# Altium schematic sheet Cover Page.SchDoc: [1] Cover Page
size A3; ApprovedBy: Nagy Richard; CheckedBy: Nagy Richard; Author: Nagy Richard; CompanyName: EmbedCore; DrawnBy: Nagy Richard; Engineer: Nagy Richard; Organization: EmbedCore; Revision: 1.0; SheetNumber: 1; SheetTotal: 24; ImagePath: .\Logo\EmbedCore.png
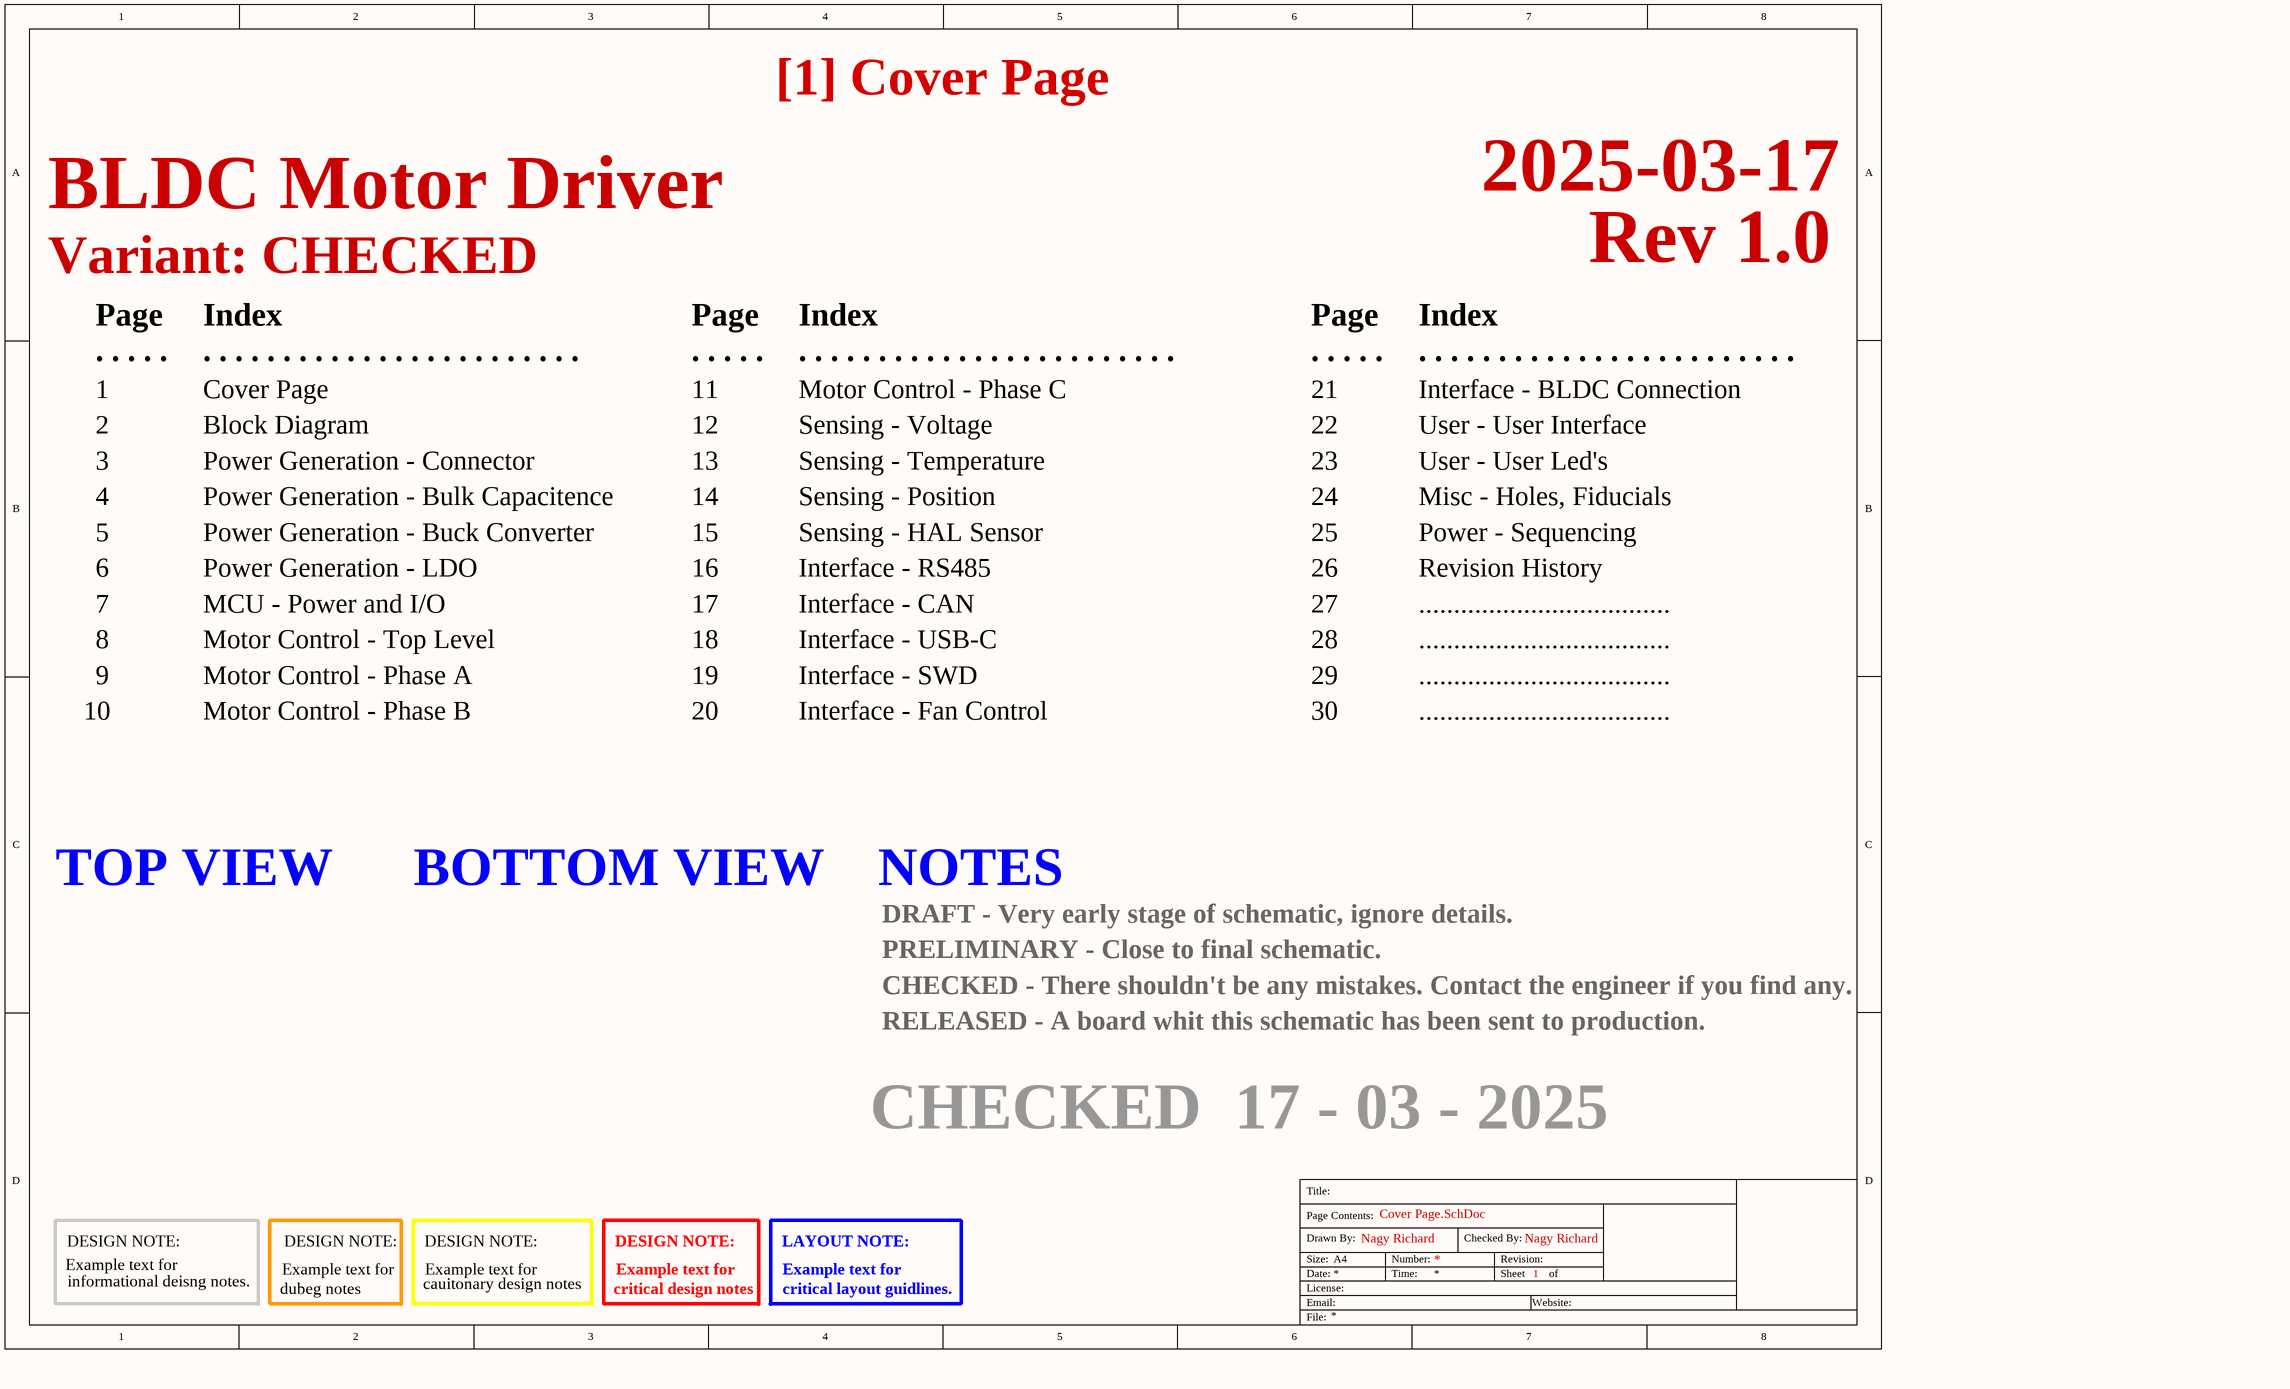
[diagram p0: Cover Page.SchDoc]

## Notes on the sheet
- BLDC Motor Driver
- 2025-03-17
- Variant: CHECKED
- Rev 1.0
- Page
- Index
- . . . . .
- 1
- . . . . . . . . . . . . . . . . . . . . . . . .
- Cover Page
- 11
- Motor Control - Phase C
- 21
- Interface - BLDC Connection
- 2
- Block Diagram
- 12
- Sensing - Voltage
- 22
- User - User Interface
- 3
- 4
- Power Generation - Connector
- Power Generation - Bulk Capacitence
- 13
- 14
- Sensing - Temperature
- Sensing - Position
- 23
- 24
- User - User Led's
- Misc - Holes, Fiducials
- 5
- 6
- Power Generation - Buck Converter
- Power Generation - LDO
- 15
- 16
- Sensing - HAL Sensor
- Interface - RS485
- 25
- 26
- Power - Sequencing
- Revision History
- 7
- MCU - Power and I/O
- 17
- Interface - CAN
- 27
- ....................................
- 8
- 9
- Motor Control - Top Level
- Motor Control - Phase A
- 18
- 19
- Interface - USB-C
- Interface - SWD
- 28
- 29
- 10
- Motor Control - Phase B
- 20
- Interface - Fan Control
- 30
- TOP VIEW
- BOTTOM VIEW
- NOTES
- DRAFT - Very early stage of schematic, ignore details.
- CHECKED - There shouldn't be any mistakes. Contact the engineer if you find any.
- PRELIMINARY - Close to final schematic.
- RELEASED - A board whit this schematic has been sent to production.
- CHECKED  17 - 03 - 2025
- DESIGN NOTE:
- LAYOUT NOTE:
- Example text for
- informational deisng notes.
- dubeg notes
- cauitonary design notes
- critical design notes
- critical layout guidlines.
- Title:
- Drawn By:
- Page Contents:
- Checked By:
- Size:
- Date:
- File:
- License:
- Email:
- A4
- Number:
- Time:
- Revision:
- Sheet
- Website:
- of